# Altium project LTE-GNSS Asset Tracker.PrjPcb (part 3 of 3)

## Sheet GPS.SchDoc
size A4
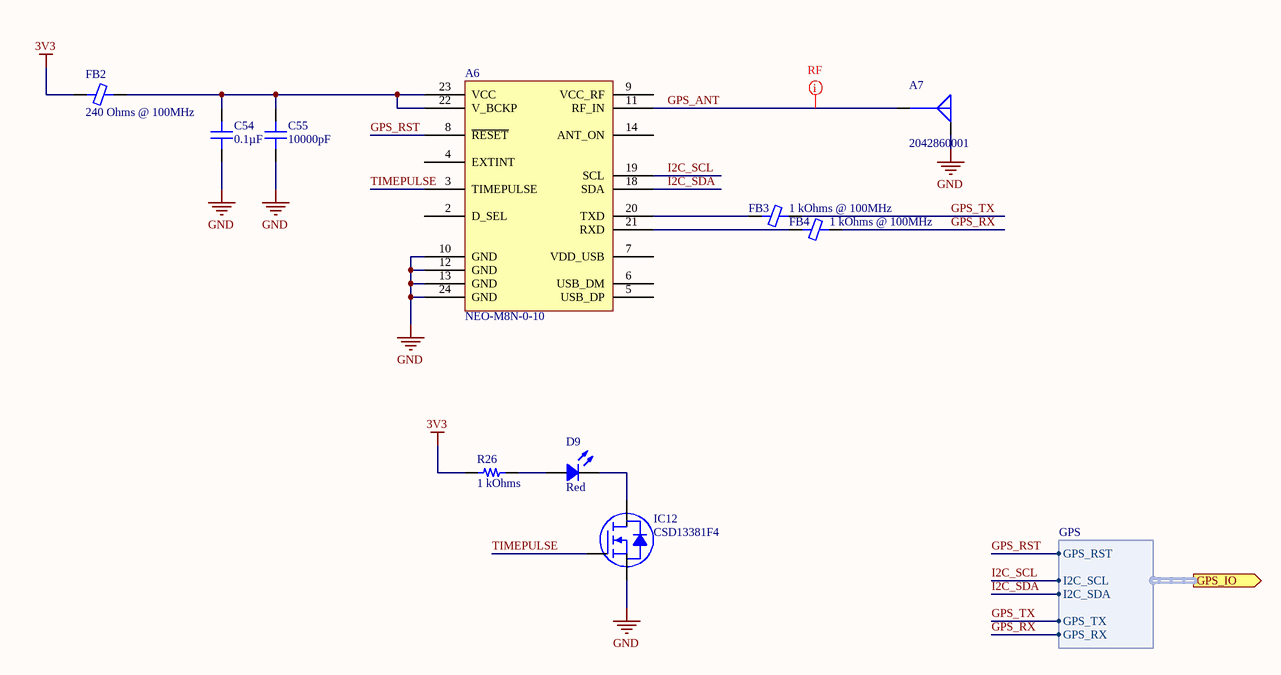
[diagram p6: GPS.SchDoc]

### Parts
A6  NEO-M8N-0-10  [U-BLOX NEO-M8N]
A7  2042860001  [MOLEX 2042860001]
C54  0.1µF  [CAP 0201_0603]
C55  10000pF  [CAP 0201_0603]
D9  Red  [LED 0402_1005 RED]
FB2  240 Ohms @ 100MHz  [FER 0201_0603]
FB3  1 kOhms @ 100MHz  [FER 0201_0603]
FB4  1 kOhms @ 100MHz  [FER 0201_0603]
IC12  CSD13381F4  [TI 3-XFDFN F4 YJC]
R26  1 kOhms  [RES 0201_0603]

### Ports
GPS_IO (out, harness GPS)

### Harnesses
GPS: I2C_SCL, I2C_SDA, GPS_TX, GPS_RX, GPS_RST

### Nets
3V3: FB2.1 R26.1
GND: A6.10(GND) A6.12(GND) A6.13(GND) A6.24(GND) A7.G C54.1 C55.1 IC12.S
GPS_ANT: A6.11(RF_IN) A7.S
GPS_RST: A6.8(~{RESET}) ; port GPS_IO.GPS_RST
GPS_RX: FB4.2 ; port GPS_IO.GPS_RX
GPS_TX: FB3.2 ; port GPS_IO.GPS_TX
I2C_SCL: A6.19(SCL) ; port GPS_IO.I2C_SCL
I2C_SDA: A6.18(SDA) ; port GPS_IO.I2C_SDA
TIMEPULSE: A6.3(TIMEPULSE) IC12.G
NetA6_20: A6.20(TXD) FB3.1
NetA6_21: A6.21(RXD) FB4.1
NetA6_22: A6.22(V_BCKP) A6.23(VCC) C54.2 C55.2 FB2.2
NetD9_1: D9.1 R26.2
NetD9_2: D9.2 IC12.D

Not connected (* = marked no-connect by the designer): A6 2(D_SEL) 4(EXTINT) 5(USB_DP) 6(USB_DM) 7(VDD_USB) 9(VCC_RF) 14(ANT_ON)

### Layout directives
net class RF: GPS_ANT

### Notes on the sheet
- Title
- Size:
- Date:
- A4
- Number:
- Time:
- Revision:
- Sheet
- of
- File:

### Library data of the parts
A6 = NEO-M8N-0-10: RF RCVR GNSS/GPS 1.575GHZ 24LCC; Manufacturer: U-Blox America Inc.; Current - Receiving: 21mA; Data Interface: I2C, SPI, UART, USB; Modulation or Protocol: BeiDou, Galileo, GLONASS, GNSS, GPS; Sensitivity: -167dBm; Voltage - Supply: 1.65V ~ 3.6V; Part Number: NEO-M8N-0-10; Applications: General Purpose; ComponentLink1Description: Datasheet; ComponentLink1URL: https://www.u-blox.com/sites/default/files/NEO-M8-FW3_DataSheet_%28UBX-15031086%29.pdf; ComponentLink2Description: DigiKey Link; ComponentLink2URL: http://digikey.com/product-detail/en/u-blox-america-inc/NEO-M8N-0-10/672-NEO-M8N-0-10CT-ND/6150671; Device Package: 24-SMD Module; Frequency: 1.575GHz; LastUpdated: 04/01/2020 00:19:34; Lifecycle Status: Active; Minimum Order: 1; Operating Temperature: -40°C ~ 85°C; Package / Case: 24-SMD Module; Packaging: ReReel; PartId: 3; Part Status: Active; Price: 0.00; Series: NEO-M8; Supplier 1: DigiKey; Supplier Part Number 1: 672-NEO-M8N-0-10CT-ND
A7 = 2042860001: RF ANT CER PATCH SOLDER SMD; Manufacturer: Molex; Antenna Type: Ceramic Patch; Frequency Group: UHF (1GHz ~ 2GHz); Gain: 5.5dBi; Number of Bands: 1; Return Loss: -10dB; RF Family/Standard: Navigation; Part Number: 2042860001; Applications: Beidou, GLONASS, GPS; ComponentLink1Description: Datasheet; ComponentLink1URL: http://www.literature.molex.com/SQLImages/kelmscott/Molex/PDF_Images/987651-5071.pdf; ComponentLink2Description: DigiKey Link; ComponentLink2URL: http://digikey.com/product-detail/en/molex/2042860001/WM16802-ND/7566910; Height (Max): 0.157" (4.00mm); LastUpdated: 12/12/2019 06:31:41; Lifecycle Status: 0; Minimum Order: 1; Mounting Type: Through Hole; Packaging: Tray; Part Status: Active; Price: 2.23; Series: *; Supplier 1: DigiKey; Supplier Part Number 1: WM16802-ND; Termination: Solder
C54 = GRM033R61C104ME84D: CAP CER 0.1UF 16V X5R 0201; Manufacturer: Murata Electronics; Tolerance: ±20%; Part Number: GRM033R61C104ME84D; Value: 0.1µF; Applications: General Purpose; Capacitance: 0.1µF; ComponentLink1Description: Datasheet; ComponentLink1URL: https://search.murata.co.jp/Ceramy/image/img/A01X/G101/ENG/GRM033R61C104ME84-01.pdf; ComponentLink2Description: DigiKey Link; ComponentLink2URL: http://digikey.com/product-detail/en/murata-electronics/GRM033R61C104ME84D/490-9986-1-ND/5026291; Device Package: 0201 (0603 Metric); LastUpdated: 21/01/2020 00:00:12; Lifecycle Status: Active; Minimum Order: 1; Mounting Type: Surface Mount, MLCC; Operating Temperature: -55°C ~ 85°C; Package / Case: 0201 (0603 Metric); Packaging: TapeAndReel; PartId: 1522; Part Status: Active; Price: 0.01; Series: GRM; Size / Dimension: 0.024" L x 0.012" W (0.60mm x 0.30mm); Supplier 1: DigiKey; Supplier Part Number 1: 490-9986-1-ND; Temperature Coefficient: X5R; Thickness (Max): 0.013" (0.33mm); Voltage - Rated: 16V
C55 = CGA1A2X7R0J103M030BA: CAP CER 10000PF 6.3V X7R 0201; Manufacturer: TDK Corporation; Tolerance: ±20%; Part Number: CGA1A2X7R0J103M030BA; Value: 10000pF; Applications: Automotive; Capacitance: 10000pF; ComponentLink1Description: Datasheet; ComponentLink1URL: https://product.tdk.com/info/en/catalog/datasheets/mlcc_automotive_general_en.pdf?ref_disty=digikey; ComponentLink2Description: DigiKey Link; ComponentLink2URL: http://digikey.com/product-detail/en/tdk-corporation/CGA1A2X7R0J103M030BA/445-12116-1-ND/3953782; Device Package: 0201 (0603 Metric); LastUpdated: 21/01/2020 00:00:11; Lifecycle Status: Active; Minimum Order: 1; Mounting Type: Surface Mount, MLCC; Operating Temperature: -55°C ~ 125°C; Package / Case: 0201 (0603 Metric); Packaging: TapeAndReel; PartId: 1683; Part Status: Active; Price: 0.01; Ratings: AEC-Q200; Series: CGA; Size / Dimension: 0.024" L x 0.012" W (0.60mm x 0.30mm); Supplier 1: DigiKey; Supplier Part Number 1: 445-12116-1-ND; Temperature Coefficient: X7R; Thickness (Max): 0.013" (0.33mm); Voltage - Rated: 6.3V
D9 = IN-S42ATR: LED RED CLEAR 0402 SMD; Manufacturer: Inolux; Configuration: Standard; Current - Test: 20mA; Lens Size: 0.60mm x 0.45mm; Lens Style: Rectangle with Flat Top; Millicandela Rating: 90mcd; Viewing Angle: 130°; Voltage - Forward (Vf) (Typ): 2.1V; Wavelength - Dominant: 631nm; Wavelength - Peak: 645nm; Part Number: IN-S42ATR; Color: Red; ComponentLink1Description: Datasheet; ComponentLink1URL: http://www.inolux-corp.com/datasheet/SMDLED/Mono%20Color%20Top%20View/IN-S42AT%20Series_V1.1.pdf; ComponentLink2Description: DigiKey Link; ComponentLink2URL: http://digikey.com/product-detail/en/inolux/IN-S42ATR/1830-1057-1-ND/7604692; Device Package: 0402 (1005 Metric); Height (Max): 0.55mm; LastUpdated: 21/01/2020 03:12:45; Lens Color: Clear; Lens Transparency: Clear; Lifecycle Status: Active; Minimum Order: 1; Mounting Type: Surface Mount; Package / Case: 0402 (1005 Metric); Packaging: TapeAndReel; PartId: 504; Part Status: Active; Price: 0.06; Series: IN-S42AT; Size / Dimension: 1.00mm L x 0.50mm W; Supplier 1: DigiKey; Supplier Part Number 1: 1830-1057-1-ND; Supplier Device Package: 0402; Value: Red
FB2 = BK0603TS241-T: FERRITE BEAD 240 OHM 0201 1LN; Manufacturer: Taiyo Yuden; Current Rating (Max): 400mA; DC Resistance (DCR) (Max): 320mOhm; Number of Lines: 1; Part Number: BK0603TS241-T; ComponentLink1Description: Datasheet; ComponentLink1URL: https://ds.yuden.co.jp/TYCOMPAS/ut/detail?pn=BK0603TS241-T  &u=M; ComponentLink2Description: DigiKey Link; ComponentLink2URL: http://digikey.com/product-detail/en/taiyo-yuden/BK0603TS241-T/587-3276-1-ND/4157923; Device Package: 0201 (0603 Metric); Height (Max): 0.013" (0.33mm); Impedance @ Frequency: 240 Ohms @ 100MHz; LastUpdated: 21/01/2020 02:24:59; Lifecycle Status: Active; Minimum Order: 1; Mounting Type: Surface Mount; Operating Temperature: -55°C ~ 125°C; Package / Case: 0201 (0603 Metric); Packaging: TapeAndReel; PartId: 40; Part Status: Active; Price: 0.03; Series: BK; Size / Dimension: 0.024" L x 0.012" W (0.60mm x 0.30mm); Supplier 1: DigiKey; Supplier Part Number 1: 587-3276-1-ND; Value: 240 Ohms @ 100MHz
FB3 FB4 = BK0603HR102-T: FERRITE BEAD 1 KOHM 0201 1LN; Manufacturer: Taiyo Yuden; Current Rating (Max): 220mA; DC Resistance (DCR) (Max): 1.15Ohm; Filter Type: Signal Line; Number of Lines: 1; Part Number: BK0603HR102-T; ComponentLink1Description: Datasheet; ComponentLink1URL: https://www.yuden.co.jp/productdata/catalog/mlci07_e.pdf; ComponentLink2Description: DigiKey Link; ComponentLink2URL: http://digikey.com/product-detail/en/taiyo-yuden/BK0603HR102-T/587-5408-1-ND/7067084; Device Package: 0201 (0603 Metric); Height (Max): 0.013" (0.33mm); Impedance @ Frequency: 1 kOhms @ 100MHz; LastUpdated: 21/01/2020 02:24:53; Lifecycle Status: Active; Minimum Order: 1; Mounting Type: Surface Mount; Operating Temperature: -55°C ~ 125°C; Package / Case: 0201 (0603 Metric); Packaging: CutTape; PartId: 137; Part Status: Active; Price: 0.10; Series: BK; Size / Dimension: 0.024" L x 0.012" W (0.60mm x 0.30mm); Supplier 1: DigiKey; Supplier Part Number 1: 587-5408-1-ND; Value: 1 kOhms @ 100MHz
IC12 = CSD13381F4: MOSFET N-CH 12V 2.1A 3PICOSTAR; Manufacturer: Texas Instruments; Current - Continuous Drain (Id) @ 25°C: 2.1A (Ta); Drive Voltage (Max Rds On,  Min Rds On): 1.8V, 4.5V; FET Type: N-Channel; Gate Charge (Qg) (Max) @ Vgs: 1.4nC @ 4.5V; Input Capacitance (Ciss) (Max) @ Vds: 200pF @ 6V; Power Dissipation (Max): 500mW (Ta); Rds On (Max) @ Id, Vgs: 180mOhm @ 500mA, 4.5V; Vgs (Max): 8V; Vgs(th) (Max) @ Id: 1.1V @ 250µA; Part Number: CSD13381F4; ComponentLink1Description: Datasheet; ComponentLink1URL: http://www.ti.com/general/docs/suppproductinfo.tsp?distId=10&gotoUrl=http%3A%2F%2Fwww.ti.com%2Flit%2Fgpn%2Fcsd13381f4; ComponentLink2Description: DigiKey Link; ComponentLink2URL: http://digikey.com/product-detail/en/texas-instruments/CSD13381F4/296-38912-1-ND/5143018; Device Package: 3-XFDFN; Drain to Source Voltage (Vdss): 12V; LastUpdated: 30/03/2020 15:00:54; Lifecycle Status: Active; Minimum Order: 1; Mounting Type: Surface Mount; Operating Temperature: -55°C ~ 150°C (TJ); Package / Case: 3-XFDFN; Packaging: TapeAndReel; Part Status: Active; Price: 0.07; Series: NexFET™; Supplier 1: DigiKey; Supplier Part Number 1: 296-38912-1-ND; Supplier Device Package: 3-PICOSTAR; Technology: MOSFET (Metal Oxide)
R26 = ERJ-1GNF1001C: RES SMD 1K OHM 1% 1/20W 0201; Manufacturer: Panasonic Electronic Components; Power (Watts): 0.05W, 1/20W; Temperature Coefficient: ±200ppm/°C; Part Number: ERJ-1GNF1001C; Value: 1 kOhms; ComponentLink1Description: Datasheet; ComponentLink1URL: https://industrial.panasonic.com/cdbs/www-data/pdf/RDA0000/AOA0000C304.pdf; ComponentLink2Description: DigiKey Link; ComponentLink2URL: http://digikey.com/product-detail/en/panasonic-electronic-components/ERJ-1GNF1001C/P122413CT-ND/7389439; Composition: Thick Film; Device Package: 0201 (0603 Metric); Features: Automotive AEC-Q200; Height - Seated (Max): 0.010" (0.26mm); LastUpdated: 21/01/2020 00:04:13; Lifecycle Status: Active; Minimum Order: 1; Number of Terminations: 2; Operating Temperature: -55°C ~ 125°C; Package / Case: 0201 (0603 Metric); Packaging: TapeAndReel; PartId: 2298; Part Status: Active; Price: 0.01; Ratings: AEC-Q200; Resistance: 1 kOhms; Series: ERJ; Size / Dimension: 0.024" L x 0.012" W (0.60mm x 0.30mm); Supplier 1: DigiKey; Supplier Part Number 1: P122413CT-ND; Supplier Device Package: 0201; Tolerance: ±1%

## Sheet Accelerometer.SchDoc
size A4
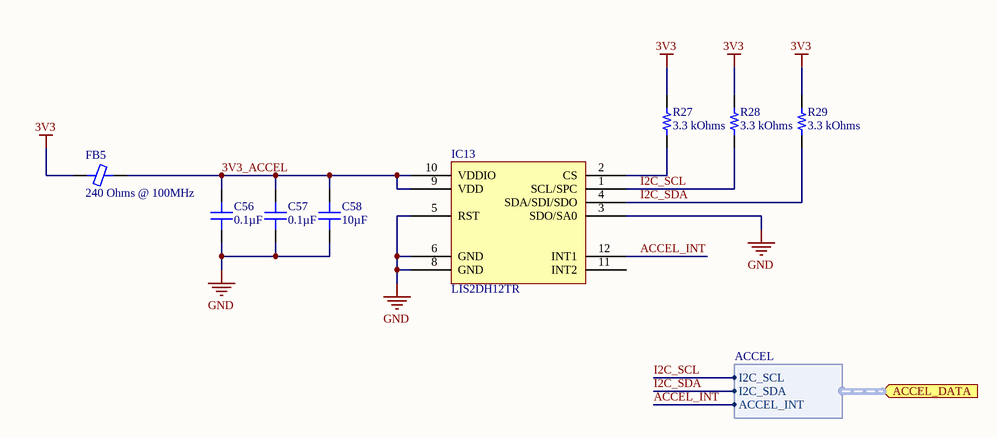
[diagram p7: Accelerometer.SchDoc]

### Parts
C56  0.1µF  [CAP 0201_0603]
C57  0.1µF  [CAP 0201_0603]
C58  10µF  [CAP 0603_1608]
FB5  240 Ohms @ 100MHz  [FER 0201_0603]
IC13  LIS2DH12TR  [ST LGA-12 2x2MM]
R27  3.3 kOhms  [RES 0201_0603]
R28  3.3 kOhms  [RES 0201_0603]
R29  3.3 kOhms  [RES 0201_0603]

### Ports
ACCEL_DATA (in, harness ACCEL)

### Harnesses
ACCEL: I2C_SCL, I2C_SDA, ACCEL_INT

### Nets
3V3: FB5.1 R27.2 R28.2 R29.2
GND: C56.1 C57.1 C58.1 IC13.3(SDO/SA0) IC13.5(RST) IC13.6(GND) IC13.8(GND)
3V3_ACCEL: C56.2 C57.2 C58.2 FB5.2 IC13.9(VDD) IC13.10(VDDIO)
ACCEL_INT: IC13.12(INT1) ; port ACCEL_DATA.ACCEL_INT
I2C_SCL: IC13.1(SCL/SPC) R28.1 ; port ACCEL_DATA.I2C_SCL
I2C_SDA: IC13.4(SDA/SDI/SDO) R29.1 ; port ACCEL_DATA.I2C_SDA
NetIC13_2: IC13.2(CS) R27.1

Not connected (* = marked no-connect by the designer): IC13 11(INT2)

### Notes on the sheet
- Title
- Size:
- Date:
- A4
- Number:
- Time:
- Revision:
- Sheet
- of
- File:

### Library data of the parts
C56 C57 = GRM033R61C104ME84D: as C54 on sheet GPS; Part Number: GRM033R61C104ME84D; Value: 0.1µF; Applications: General Purpose; Capacitance: 0.1µF; ComponentLink1Description: Datasheet; ComponentLink1URL: https://search.murata.co.jp/Ceramy/image/img/A01X/G101/ENG/GRM033R61C104ME84-01.pdf; ComponentLink2Description: DigiKey Link; ComponentLink2URL: http://digikey.com/product-detail/en/murata-electronics/GRM033R61C104ME84D/490-9986-1-ND/5026291; Device Package: 0201 (0603 Metric); LastUpdated: 21/01/2020 00:00:12; Lifecycle Status: Active; Minimum Order: 1; Mounting Type: Surface Mount, MLCC; Operating Temperature: -55°C ~ 85°C; Package / Case: 0201 (0603 Metric); Packaging: TapeAndReel; PartId: 1522; Part Status: Active; Price: 0.01; Series: GRM; Size / Dimension: 0.024" L x 0.012" W (0.60mm x 0.30mm); Supplier 1: DigiKey; Supplier Part Number 1: 490-9986-1-ND; Temperature Coefficient: X5R; Thickness (Max): 0.013" (0.33mm); Voltage - Rated: 16V
C58 = LMK107BBJ106KALT: CAP CER 10UF 10V X5R 0603; Manufacturer: Taiyo Yuden; Tolerance: ±10%; Part Number: LMK107BBJ106KALT; Value: 10µF; Applications: SMPS Filtering; Capacitance: 10µF; ComponentLink1Description: Datasheet; ComponentLink1URL: https://ds.yuden.co.jp/TYCOMPAS/ut/detail?pn=LMK107BBJ106KALT &u=M; ComponentLink2Description: DigiKey Link; ComponentLink2URL: http://digikey.com/product-detail/en/taiyo-yuden/LMK107BBJ106KALT/587-6017-1-ND/8040680; Device Package: 0603 (1608 Metric); LastUpdated: 21/01/2020 00:01:56; Lifecycle Status: Active; Minimum Order: 1; Mounting Type: Surface Mount, MLCC; Operating Temperature: -55°C ~ 85°C; Package / Case: 0603 (1608 Metric); Packaging: TapeAndReel; PartId: 10454; Part Status: Active; Price: 0.03; Series: M; Size / Dimension: 0.063" L x 0.031" W (1.60mm x 0.80mm); Supplier 1: DigiKey; Supplier Part Number 1: 587-6017-1-ND; Temperature Coefficient: X5R; Thickness (Max): 0.039" (1.00mm); Voltage - Rated: 10V
FB5 = BK0603TS241-T: as FB2 on sheet GPS; Part Number: BK0603TS241-T; ComponentLink1Description: Datasheet; ComponentLink1URL: https://ds.yuden.co.jp/TYCOMPAS/ut/detail?pn=BK0603TS241-T  &u=M; ComponentLink2Description: DigiKey Link; ComponentLink2URL: http://digikey.com/product-detail/en/taiyo-yuden/BK0603TS241-T/587-3276-1-ND/4157923; Device Package: 0201 (0603 Metric); Height (Max): 0.013" (0.33mm); Impedance @ Frequency: 240 Ohms @ 100MHz; LastUpdated: 21/01/2020 02:24:59; Lifecycle Status: Active; Minimum Order: 1; Mounting Type: Surface Mount; Operating Temperature: -55°C ~ 125°C; Package / Case: 0201 (0603 Metric); Packaging: TapeAndReel; PartId: 40; Part Status: Active; Price: 0.03; Series: BK; Size / Dimension: 0.024" L x 0.012" W (0.60mm x 0.30mm); Supplier 1: DigiKey; Supplier Part Number 1: 587-3276-1-ND; Value: 240 Ohms @ 100MHz
IC13 = LIS2DH12TR: ACCEL 2-16G I2C/SPI 12LGA; Manufacturer: STMicroelectronics; Acceleration Range: ±2g, 4g, 8g, 16g; Axis: X, Y, Z; Bandwidth: 0.5Hz ~ 672Hz; Output Type: I²C, SPI; Sensitivity (LSB/g): 1000 (±2g) ~ 83 (±16g); Voltage - Supply: 1.71V ~ 3.6V; Part Number: LIS2DH12TR; ComponentLink1Description: Datasheet; ComponentLink1URL: http://www.st.com/content/ccc/resource/technical/document/datasheet/12/c0/5c/36/b9/58/46/f2/DM00091513.pdf/files/DM00091513.pdf/jcr:content/translations/en.DM00091513.pdf; ComponentLink2Description: DigiKey Link; ComponentLink2URL: http://digikey.com/product-detail/en/stmicroelectronics/LIS2DH12TR/497-14851-1-ND/4899838; Device Package: 12-VFLGA; Features: Adjustable Bandwidth, Selectable Scale, Sleep Mode, Temperature Sensor; LastUpdated: 30/03/2020 15:41:11; Lifecycle Status: Active; Minimum Order: 1; Mounting Type: Surface Mount; Operating Temperature: -40°C ~ 85°C (TA); Package / Case: 12-VFLGA; Packaging: TapeAndReel; Part Status: Active; Price: 0.60; Series: -; Supplier 1: DigiKey; Supplier Part Number 1: 497-14851-1-ND; Supplier Device Package: 12-LGA (2x2); Type: Digital
R27-R29 = ERJ-1GNF3301C: RES SMD 3.3K OHM 1% 1/20W 0201; Manufacturer: Panasonic Electronic Components; Power (Watts): 0.05W, 1/20W; Temperature Coefficient: ±200ppm/°C; Part Number: ERJ-1GNF3301C; Value: 3.3 kOhms; ComponentLink1Description: Datasheet; ComponentLink1URL: https://industrial.panasonic.com/cdbs/www-data/pdf/RDA0000/AOA0000C304.pdf; ComponentLink2Description: DigiKey Link; ComponentLink2URL: http://digikey.com/product-detail/en/panasonic-electronic-components/ERJ-1GNF3301C/P122937CT-ND/8342813; Composition: Thick Film; Device Package: 0201 (0603 Metric); Features: Automotive AEC-Q200; Height - Seated (Max): 0.010" (0.26mm); LastUpdated: 21/01/2020 00:04:10; Lifecycle Status: Active; Minimum Order: 1; Number of Terminations: 2; Operating Temperature: -55°C ~ 125°C; Package / Case: 0201 (0603 Metric); Packaging: TapeAndReel; PartId: 4142; Part Status: Active; Price: 0.01; Ratings: AEC-Q200; Resistance: 3.3 kOhms; Series: ERJ; Size / Dimension: 0.024" L x 0.012" W (0.60mm x 0.30mm); Supplier 1: DigiKey; Supplier Part Number 1: P122937CT-ND; Supplier Device Package: 0201; Tolerance: ±1%

## Sheet Battery Power.SchDoc
size A4
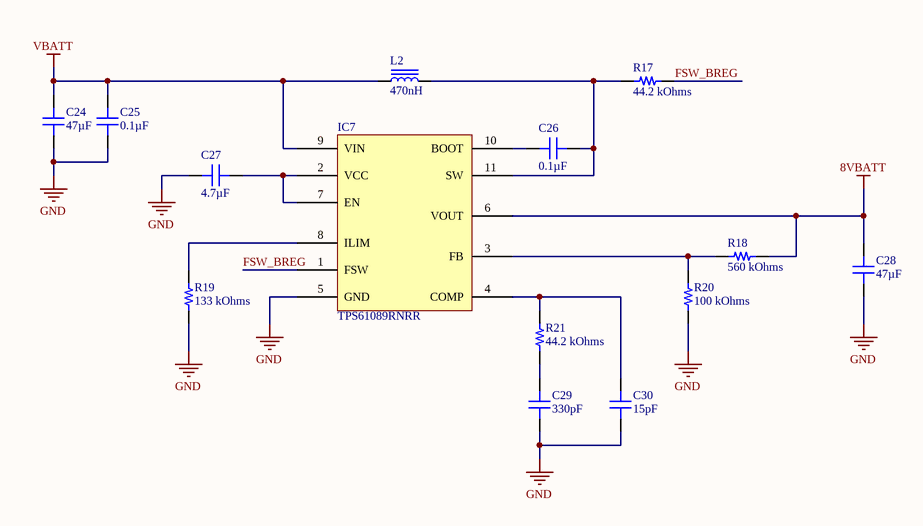
[diagram p8: Battery Power.SchDoc]

### Parts
C24  47µF  [CAP 1210_3225 - 2.8MM]
C25  0.1µF  [CAP 0201_0603]
C26  0.1µF  [CAP 0201_0603]
C27  4.7µF  [CAP 0402_1005]
C28  47µF  [CAP 1210_3225 - 2.8MM]
C29  330pF  [CAP 0201_0603]
C30  15pF  [CAP 0201_0603]
IC7  TPS61089RNRR  [TI VQFN-11 2.5x2.1 RNR]
L2  470nH  [BOURNS SRP5030T]
R17  44.2 kOhms  [RES 0201_0603]
R18  560 kOhms  [RES 0201_0603]
R19  133 kOhms  [RES 0201_0603]
R20  100 kOhms  [RES 0201_0603]
R21  44.2 kOhms  [RES 0201_0603]

### Nets
8VBATT: C28.2 IC7.6(VOUT) R18.1
GND: C24.1 C25.1 C27.1 C28.1 C29.1 C30.1 IC7.5(GND) R19.1 R20.1
VBATT: C24.2 C25.2 IC7.9(VIN) L2.1
FSW_BREG: IC7.1(FSW) R17.2
NetC26_1: C26.1 IC7.11(SW) L2.2 R17.1
NetC26_2: C26.2 IC7.10(BOOT)
NetC27_2: C27.2 IC7.2(VCC) IC7.7(EN)
NetC29_2: C29.2 R21.1
NetC30_2: C30.2 IC7.4(COMP) R21.2
NetIC7_3: IC7.3(FB) R18.2 R20.2
NetIC7_8: IC7.8(ILIM) R19.2

### Notes on the sheet
- Title
- Size:
- Date:
- A4
- Number:
- Time:
- Revision:
- Sheet
- of
- File:

### Library data of the parts
C24 = LMK325B7476MM-PR: CAP CER 47UF 10V X7R 1210; Manufacturer: Taiyo Yuden; Tolerance: ±20%; Part Number: LMK325B7476MM-PR; Value: 47µF; Applications: General Purpose; Capacitance: 47µF; ComponentLink1Description: Datasheet; ComponentLink1URL: https://www.yuden.co.jp/productdata/catalog/mlcc01_e.pdf; ComponentLink2Description: DigiKey Link; ComponentLink2URL: http://digikey.com/product-detail/en/taiyo-yuden/LMK325B7476MM-PR/587-5922-1-ND/7675042; Device Package: 1210 (3225 Metric); LastUpdated: 21/01/2020 00:30:21; Lifecycle Status: Active; Minimum Order: 1; Mounting Type: Surface Mount, MLCC; Operating Temperature: -55°C ~ 125°C; Package / Case: 1210 (3225 Metric); Packaging: TapeAndReel; PartId: 24091; Part Status: Active; Price: 0.28; Series: M; Size / Dimension: 0.126" L x 0.098" W (3.20mm x 2.50mm); Supplier 1: DigiKey; Supplier Part Number 1: 587-5922-1-ND; Temperature Coefficient: X7R; Thickness (Max): 0.106" (2.70mm); Voltage - Rated: 10V
C25 C26 = GRM033R61C104ME84D: as C54 on sheet GPS; Part Number: GRM033R61C104ME84D; Value: 0.1µF; Applications: General Purpose; Capacitance: 0.1µF; ComponentLink1Description: Datasheet; ComponentLink1URL: https://search.murata.co.jp/Ceramy/image/img/A01X/G101/ENG/GRM033R61C104ME84-01.pdf; ComponentLink2Description: DigiKey Link; ComponentLink2URL: http://digikey.com/product-detail/en/murata-electronics/GRM033R61C104ME84D/490-9986-1-ND/5026291; Device Package: 0201 (0603 Metric); LastUpdated: 21/01/2020 00:00:12; Lifecycle Status: Active; Minimum Order: 1; Mounting Type: Surface Mount, MLCC; Operating Temperature: -55°C ~ 85°C; Package / Case: 0201 (0603 Metric); Packaging: TapeAndReel; PartId: 1522; Part Status: Active; Price: 0.01; Series: GRM; Size / Dimension: 0.024" L x 0.012" W (0.60mm x 0.30mm); Supplier 1: DigiKey; Supplier Part Number 1: 490-9986-1-ND; Temperature Coefficient: X5R; Thickness (Max): 0.013" (0.33mm); Voltage - Rated: 16V
C27 = CL05A475KP5NRNC: CAP CER 4.7UF 10V X5R 0402; Manufacturer: Samsung Electro-Mechanics; Tolerance: ±10%; Part Number: CL05A475KP5NRNC; Value: 4.7µF; Applications: General Purpose; Capacitance: 4.7µF; ComponentLink1Description: Datasheet; ComponentLink1URL: http://www.samsungsem.com/kr/support/product-search/mlcc/CL05A475KP5NRNC.jsp; ComponentLink2Description: DigiKey Link; ComponentLink2URL: http://digikey.com/product-detail/en/samsung-electro-mechanics/CL05A475KP5NRNC/1276-1480-1-ND/3889566; Device Package: 0402 (1005 Metric); LastUpdated: 01/04/2020 23:57:03; Lifecycle Status: Active; Minimum Order: 1; Mounting Type: Surface Mount, MLCC; Operating Temperature: -55°C ~ 85°C; Package / Case: 0402 (1005 Metric); Packaging: TapeAndReel; PartId: 2191; Part Status: Active; Price: 0.08; Series: CL; Size / Dimension: 0.039" L x 0.020" W (1.00mm x 0.50mm); Supplier 1: DigiKey; Supplier Part Number 1: 1276-1480-1-ND; Temperature Coefficient: X5R; Thickness (Max): 0.022" (0.55mm); Voltage - Rated: 10V
C28 = C1210C476M4PACTU: CAP CER 47UF 16V X5R 1210; Manufacturer: KEMET; Tolerance: ±20%; Part Number: C1210C476M4PACTU; Value: 47µF; Applications: General Purpose; Capacitance: 47µF; ComponentLink1Description: Datasheet; ComponentLink1URL: https://api.kemet.com/component-edge/download/datasheet/C1210C476M4PACTU.pdf; ComponentLink2Description: DigiKey Link; ComponentLink2URL: http://digikey.com/product-detail/en/kemet/C1210C476M4PACTU/399-5514-1-ND/1950692; Device Package: 1210 (3225 Metric); LastUpdated: 21/01/2020 00:30:39; Lifecycle Status: Active; Minimum Order: 1; Mounting Type: Surface Mount, MLCC; Operating Temperature: -55°C ~ 85°C; Package / Case: 1210 (3225 Metric); Packaging: TapeAndReel; PartId: 23816; Part Status: Active; Price: 0.38; Series: SMD Comm X5R; Size / Dimension: 0.126" L x 0.098" W (3.20mm x 2.50mm); Supplier 1: DigiKey; Supplier Part Number 1: 399-5514-1-ND; Temperature Coefficient: X5R; Thickness (Max): 0.110" (2.80mm); Voltage - Rated: 16V
C29 = CL03B331KA3NNNC: CAP CER 330PF 25V X7R 0201; Manufacturer: Samsung Electro-Mechanics; Tolerance: ±10%; Part Number: CL03B331KA3NNNC; Value: 330pF; Applications: General Purpose; Capacitance: 330pF; ComponentLink1Description: Datasheet; ComponentLink1URL: http://www.samsungsem.com/kr/support/product-search/mlcc/CL03B331KA3NNNC.jsp; ComponentLink2Description: DigiKey Link; ComponentLink2URL: http://digikey.com/product-detail/en/samsung-electro-mechanics/CL03B331KA3NNNC/1276-1351-1-ND/3889437; Device Package: 0201 (0603 Metric); LastUpdated: 21/01/2020 00:00:16; Lifecycle Status: Active; Minimum Order: 1; Mounting Type: Surface Mount, MLCC; Operating Temperature: -55°C ~ 125°C; Package / Case: 0201 (0603 Metric); Packaging: TapeAndReel; PartId: 781; Part Status: Active; Price: 0.01; Series: CL; Size / Dimension: 0.024" L x 0.012" W (0.60mm x 0.30mm); Supplier 1: DigiKey; Supplier Part Number 1: 1276-1351-1-ND; Temperature Coefficient: X7R; Thickness (Max): 0.013" (0.33mm); Voltage - Rated: 25V
C30 = CGA1A2C0G1E150J030BA: CAP CER 15PF 25V C0G 0201; Manufacturer: TDK Corporation; Temperature Coefficient: C0G, NP0; Tolerance: ±5%; Part Number: CGA1A2C0G1E150J030BA; Value: 15pF; Applications: Automotive; Capacitance: 15pF; ComponentLink1Description: Datasheet; ComponentLink1URL: https://product.tdk.com/info/en/catalog/datasheets/mlcc_automotive_general_en.pdf?ref_disty=digikey; ComponentLink2Description: DigiKey Link; ComponentLink2URL: http://digikey.com/product-detail/en/tdk-corporation/CGA1A2C0G1E150J030BA/445-9034-1-ND/3648614; Device Package: 0201 (0603 Metric); LastUpdated: 21/01/2020 00:00:11; Lifecycle Status: Active; Minimum Order: 1; Mounting Type: Surface Mount, MLCC; Operating Temperature: -55°C ~ 125°C; Package / Case: 0201 (0603 Metric); Packaging: TapeAndReel; PartId: 1675; Part Status: Active; Price: 0.01; Ratings: AEC-Q200; Series: CGA; Size / Dimension: 0.024" L x 0.012" W (0.60mm x 0.30mm); Supplier 1: DigiKey; Supplier Part Number 1: 445-9034-1-ND; Thickness (Max): 0.013" (0.33mm); Voltage - Rated: 25V
IC7 = TPS61089RNRR: IC REG BOOST ADJ 7A 11VQFN; Manufacturer: Texas Instruments; Frequency - Switching: 200kHz ~ 2.2MHz; Function: Step-Up; Number of Outputs: 1; Output Configuration: Positive; Output Type: Adjustable; Synchronous Rectifier: Yes; Voltage - Input (Max): 12V; Voltage - Input (Min): 2.7V; Voltage - Output (Max): 12.6V; Voltage - Output (Min/Fixed): 4.5V; Part Number: TPS61089RNRR; ComponentLink1Description: Datasheet; ComponentLink1URL: http://www.ti.com/general/docs/suppproductinfo.tsp?distId=10&gotoUrl=http%3A%2F%2Fwww.ti.com%2Flit%2Fgpn%2Ftps61089; ComponentLink2Description: DigiKey Link; ComponentLink2URL: http://digikey.com/product-detail/en/texas-instruments/TPS61089RNRR/296-47295-1-ND/7688305; Current - Output: 7A; Device Package: 11-VFQFN; LastUpdated: 05/04/2020 02:30:28; Lifecycle Status: Active; Minimum Order: 1; Mounting Type: Surface Mount; Operating Temperature: -40°C ~ 125°C (TJ); Package / Case: 11-VFQFN; Packaging: TapeAndReel; Part Status: Active; Price: 1.26; Series: -; Supplier 1: DigiKey; Supplier Part Number 1: 296-47295-1-ND; Supplier Device Package: 11-VQFN-HR (2.5x2); Topology: Boost
L2 = SRP5030T-R47M: FIXED IND 470NH 12A 7.4 MOHM SMD; Manufacturer: Bourns Inc.; Current - Saturation: 16A; DC Resistance (DCR): 7.4mOhm Max; Inductance Frequency - Test: 100kHz; Material - Core: Iron Powder; Shielding: Shielded; Tolerance: ±20%; Type: Wirewound; Part Number: SRP5030T-R47M; ComponentLink1Description: Datasheet; ComponentLink1URL: https://www.bourns.com/docs/Product-Datasheets/SRP5030T.pdf; ComponentLink2Description: DigiKey Link; ComponentLink2URL: http://digikey.com/product-detail/en/bourns-inc/SRP5030T-R47M/SRP5030T-R47MCT-ND/3986019; Current Rating (Amps): 12A; Device Package: Nonstandard; Height - Seated (Max): 0.118" (3.00mm); Inductance: 470nH; LastUpdated: 21/01/2020 03:25:23; Lifecycle Status: Active; Minimum Order: 1; Mounting Type: Surface Mount; Operating Temperature: -40°C ~ 125°C; Package / Case: Nonstandard; Packaging: TapeAndReel; PartId: 5; Part Status: Active; Price: 0.66; Series: SRP5030T; Size / Dimension: 0.224" L x 0.205" W (5.70mm x 5.20mm); Supplier 1: DigiKey; Supplier Part Number 1: SRP5030T-R47MCT-ND; Value: 470nH
R17 R21 = ERJ-1GNF4422C: RES SMD 44.2K OHM 1% 1/20W 0201; Manufacturer: Panasonic Electronic Components; Power (Watts): 0.05W, 1/20W; Temperature Coefficient: ±200ppm/°C; Part Number: ERJ-1GNF4422C; Value: 44.2 kOhms; ComponentLink1Description: Datasheet; ComponentLink1URL: https://industrial.panasonic.com/cdbs/www-data/pdf/RDA0000/AOA0000C304.pdf; ComponentLink2Description: DigiKey Link; ComponentLink2URL: http://digikey.com/product-detail/en/panasonic-electronic-components/ERJ-1GNF4422C/P123017CT-ND/8342973; Composition: Thick Film; Device Package: 0201 (0603 Metric); Features: Automotive AEC-Q200; Height - Seated (Max): 0.010" (0.26mm); LastUpdated: 21/01/2020 00:04:13; Lifecycle Status: Active; Minimum Order: 1; Number of Terminations: 2; Operating Temperature: -55°C ~ 125°C; Package / Case: 0201 (0603 Metric); Packaging: TapeAndReel; PartId: 2403; Part Status: Active; Price: 0.01; Ratings: AEC-Q200; Resistance: 44.2 kOhms; Series: ERJ; Size / Dimension: 0.024" L x 0.012" W (0.60mm x 0.30mm); Supplier 1: DigiKey; Supplier Part Number 1: P123017CT-ND; Supplier Device Package: 0201; Tolerance: ±1%
R18 = ERJ-1GNF5603C: RES SMD 560K OHM 1% 1/20W 0201; Manufacturer: Panasonic Electronic Components; Power (Watts): 0.05W, 1/20W; Temperature Coefficient: ±200ppm/°C; Part Number: ERJ-1GNF5603C; Value: 560 kOhms; ComponentLink1Description: Datasheet; ComponentLink1URL: https://industrial.panasonic.com/cdbs/www-data/pdf/RDA0000/AOA0000C304.pdf; ComponentLink2Description: DigiKey Link; ComponentLink2URL: http://digikey.com/product-detail/en/panasonic-electronic-components/ERJ-1GNF5603C/P123077CT-ND/8343093; Composition: Thick Film; Device Package: 0201 (0603 Metric); Features: Automotive AEC-Q200; Height - Seated (Max): 0.010" (0.26mm); LastUpdated: 21/01/2020 00:04:10; Lifecycle Status: Active; Minimum Order: 1; Number of Terminations: 2; Operating Temperature: -55°C ~ 125°C; Package / Case: 0201 (0603 Metric); Packaging: TapeAndReel; PartId: 4184; Part Status: Active; Price: 0.01; Ratings: AEC-Q200; Resistance: 560 kOhms; Series: ERJ; Size / Dimension: 0.024" L x 0.012" W (0.60mm x 0.30mm); Supplier 1: DigiKey; Supplier Part Number 1: P123077CT-ND; Supplier Device Package: 0201; Tolerance: ±1%
R19 = ERJ-1GNF1333C: RES SMD 133K OHM 1% 1/20W 0201; Manufacturer: Panasonic Electronic Components; Power (Watts): 0.05W, 1/20W; Temperature Coefficient: ±200ppm/°C; Part Number: ERJ-1GNF1333C; Value: 133 kOhms; ComponentLink1Description: Datasheet; ComponentLink1URL: https://industrial.panasonic.com/cdbs/www-data/pdf/RDA0000/AOA0000C304.pdf; ComponentLink2Description: DigiKey Link; ComponentLink2URL: http://digikey.com/product-detail/en/panasonic-electronic-components/ERJ-1GNF1333C/P122719CT-ND/8342377; Composition: Thick Film; Device Package: 0201 (0603 Metric); Features: Automotive AEC-Q200; Height - Seated (Max): 0.010" (0.26mm); LastUpdated: 21/01/2020 00:04:13; Lifecycle Status: Active; Minimum Order: 1; Number of Terminations: 2; Operating Temperature: -55°C ~ 125°C; Package / Case: 0201 (0603 Metric); Packaging: TapeAndReel; PartId: 2343; Part Status: Active; Price: 0.01; Ratings: AEC-Q200; Resistance: 133 kOhms; Series: ERJ; Size / Dimension: 0.024" L x 0.012" W (0.60mm x 0.30mm); Supplier 1: DigiKey; Supplier Part Number 1: P122719CT-ND; Supplier Device Package: 0201; Tolerance: ±1%
R20 = ERJ-1GNF1003C: RES SMD 100K OHM 1% 1/20W 0201; Manufacturer: Panasonic Electronic Components; Power (Watts): 0.05W, 1/20W; Temperature Coefficient: ±200ppm/°C; Part Number: ERJ-1GNF1003C; Value: 100 kOhms; ComponentLink1Description: Datasheet; ComponentLink1URL: https://industrial.panasonic.com/cdbs/www-data/pdf/RDA0000/AOA0000C304.pdf; ComponentLink2Description: DigiKey Link; ComponentLink2URL: http://digikey.com/product-detail/en/panasonic-electronic-components/ERJ-1GNF1003C/P122655CT-ND/8342249; Composition: Thick Film; Device Package: 0201 (0603 Metric); Features: Automotive AEC-Q200; Height - Seated (Max): 0.010" (0.26mm); LastUpdated: 21/01/2020 00:04:18; Lifecycle Status: Active; Minimum Order: 1; Number of Terminations: 2; Operating Temperature: -55°C ~ 125°C; Package / Case: 0201 (0603 Metric); Packaging: TapeAndReel; PartId: 819; Part Status: Active; Price: 0.01; Ratings: AEC-Q200; Resistance: 100 kOhms; Series: ERJ; Size / Dimension: 0.024" L x 0.012" W (0.60mm x 0.30mm); Supplier 1: DigiKey; Supplier Part Number 1: P122655CT-ND; Supplier Device Package: 0201; Tolerance: ±1%

## Sheet Microcontroller.SchDoc
size A4
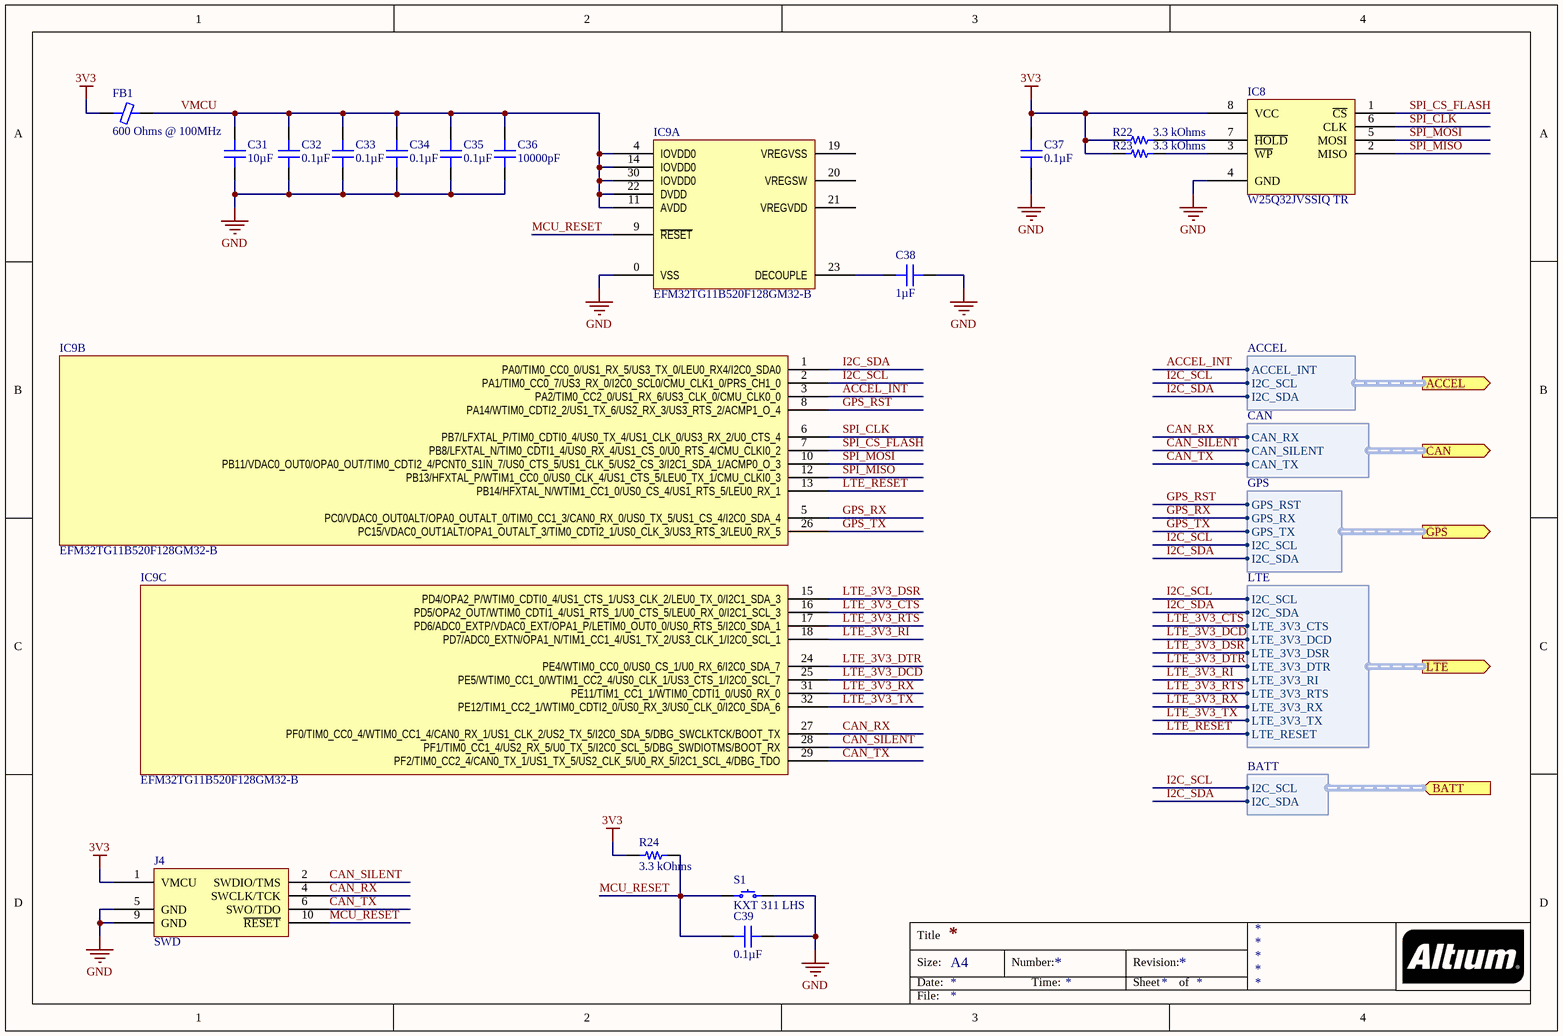
[diagram p9: Microcontroller.SchDoc]

### Parts
C31  10µF  [CAP 0402_1005]
C32  0.1µF  [CAP 0201_0603]
C33  0.1µF  [CAP 0201_0603]
C34  0.1µF  [CAP 0201_0603]
C35  0.1µF  [CAP 0201_0603]
C36  10000pF  [CAP 0201_0603]
C37  0.1µF  [CAP 0201_0603]
C38  1µF  [CAP 0402_1005]
C39  0.1µF  [CAP 0201_0603]
FB1  600 Ohms @ 100MHz  [FER 0402_1005]
IC8  W25Q32JVSSIQ TR  [WINBOND SOIC-8 208MIL WIDE]
IC9  EFM32TG11B520F128GM32-B  [SI LABS QFN-32(5x5)]  (parts A,B,C of 3)
J4  SWD  [10 Pin SWD]  (no BOM)
R22  3.3 kOhms  [RES 0201_0603]
R23  3.3 kOhms  [RES 0201_0603]
R24  3.3 kOhms  [RES 0201_0603]
S1  KXT 311 LHS  [C&K KXT3]

### Ports
ACCEL (out, harness ACCEL), BATT (in, harness BATT), CAN (out, harness CAN), GPS (out, harness GPS), LTE (out, harness LTE)

### Harnesses
ACCEL: ACCEL_INT, I2C_SCL, I2C_SDA
CAN: CAN_RX, CAN_SILENT, CAN_TX
GPS: GPS_RST, GPS_RX, GPS_TX, I2C_SCL, I2C_SDA
LTE: I2C_SCL, I2C_SDA, LTE_3V3_CTS, LTE_3V3_DCD, LTE_3V3_DSR, LTE_3V3_DTR, LTE_3V3_RI, LTE_3V3_RTS, LTE_3V3_RX, LTE_3V3_TX, LTE_RESET
BATT: I2C_SCL, I2C_SDA

### Nets
3V3: C37.2 FB1.1 IC8.8(VCC) J4.1(VMCU) R22.2 R23.2 R24.2
GND: C31.1 C32.1 C33.1 C34.1 C35.1 C36.1 C37.1 C38.2 C39.1 IC8.4(GND) IC9.0(VSS) J4.5(GND) J4.9(GND) S1.2
ACCEL_INT: IC9.3(PA2/TIM0_CC2_0/US1_RX_6/US3_CLK_0/CMU_CLK0_0) ; port ACCEL.ACCEL_INT
CAN_RX: IC9.27(PF0/TIM0_CC0_4/WTIM0_CC1_4/CAN0_RX_1/US1_CLK_2/US2_TX_5/I2C0_SDA_5/DBG_SWCLKTCK/BOOT_TX) J4.4(SWCLK/TCK) ; port CAN.CAN_RX
CAN_SILENT: IC9.28(PF1/TIM0_CC1_4/US2_RX_5/U0_TX_5/I2C0_SCL_5/DBG_SWDIOTMS/BOOT_RX) J4.2(SWDIO/TMS) ; port CAN.CAN_SILENT
CAN_TX: IC9.29(PF2/TIM0_CC2_4/CAN0_TX_1/US1_TX_5/US2_CLK_5/U0_RX_5/I2C1_SCL_4/DBG_TDO) J4.6(SWO/TDO) ; port CAN.CAN_TX
GPS_RST: IC9.8(PA14/WTIM0_CDTI2_2/US1_TX_6/US2_RX_3/US3_RTS_2/ACMP1_O_4) ; port GPS.GPS_RST
GPS_RX: IC9.5(PC0/VDAC0_OUT0ALT/OPA0_OUTALT_0/TIM0_CC1_3/CAN0_RX_0/US0_TX_5/US1_CS_4/I2C0_SDA_4) ; port GPS.GPS_RX
GPS_TX: IC9.26(PC15/VDAC0_OUT1ALT/OPA1_OUTALT_3/TIM0_CDTI2_1/US0_CLK_3/US3_RTS_3/LEU0_RX_5) ; port GPS.GPS_TX
I2C_SCL: IC9.2(PA1/TIM0_CC0_7/US3_RX_0/I2C0_SCL0/CMU_CLK1_0/PRS_CH1_0) ; port ACCEL.I2C_SCL, port GPS.I2C_SCL, port LTE.I2C_SCL, port BATT.I2C_SCL
I2C_SDA: IC9.1(PA0/TIM0_CC0_0/US1_RX_5/US3_TX_0/LEU0_RX4/I2C0_SDA0) ; port ACCEL.I2C_SDA, port GPS.I2C_SDA, port LTE.I2C_SDA, port BATT.I2C_SDA
LTE_3V3_CTS: IC9.16(PD5/OPA2_OUT/WTIM0_CDTI1_4/US1_RTS_1/U0_CTS_5/LEU0_RX_0/I2C1_SCL_3) ; port LTE.LTE_3V3_CTS
LTE_3V3_DCD: IC9.25(PE5/WTIM0_CC1_0/WTIM1_CC2_4/US0_CLK_1/US3_CTS_1/I2C0_SCL_7) ; port LTE.LTE_3V3_DCD
LTE_3V3_DSR: IC9.15(PD4/OPA2_P/WTIM0_CDTI0_4/US1_CTS_1/US3_CLK_2/LEU0_TX_0/I2C1_SDA_3) ; port LTE.LTE_3V3_DSR
LTE_3V3_DTR: IC9.24(PE4/WTIM0_CC0_0/US0_CS_1/U0_RX_6/I2C0_SDA_7) ; port LTE.LTE_3V3_DTR
LTE_3V3_RI: IC9.18(PD7/ADC0_EXTN/OPA1_N/TIM1_CC1_4/US1_TX_2/US3_CLK_1/I2C0_SCL_1) ; port LTE.LTE_3V3_RI
LTE_3V3_RTS: IC9.17(PD6/ADC0_EXTP/VDAC0_EXT/OPA1_P/LETIM0_OUT0_0/US0_RTS_5/I2C0_SDA_1) ; port LTE.LTE_3V3_RTS
LTE_3V3_RX: IC9.31(PE11/TIM1_CC1_1/WTIM0_CDTI1_0/US0_RX_0) ; port LTE.LTE_3V3_RX
LTE_3V3_TX: IC9.32(PE12/TIM1_CC2_1/WTIM0_CDTI2_0/US0_RX_3/US0_CLK_0/I2C0_SDA_6) ; port LTE.LTE_3V3_TX
LTE_RESET: IC9.13(PB14/HFXTAL_N/WTIM1_CC1_0/US0_CS_4/US1_RTS_5/LEU0_RX_1) ; port LTE.LTE_RESET
MCU_RESET: C39.2 IC9.9(~{RESET}) J4.10(~{RESET}) R24.1 S1.1
SPI_CLK: IC8.6(CLK) IC9.6(PB7/LFXTAL_P/TIM0_CDTI0_4/US0_TX_4/US1_CLK_0/US3_RX_2/U0_CTS_4)
SPI_CS_FLASH: IC8.1(~{CS}) IC9.7(PB8/LFXTAL_N/TIM0_CDTI1_4/US0_RX_4/US1_CS_0/U0_RTS_4/CMU_CLKI0_2)
SPI_MISO: IC8.2(MISO) IC9.12(PB13/HFXTAL_P/WTIM1_CC0_0/US0_CLK_4/US1_CTS_5/LEU0_TX_1/CMU_CLKI0_3)
SPI_MOSI: IC8.5(MOSI) IC9.10(PB11/VDAC0_OUT0/OPA0_OUT/TIM0_CDTI2_4/PCNT0_S1IN_7/US0_CTS_5/US1_CLK_5/US2_CS_3/I2C1_SDA_1/ACMP0_O_3)
VMCU: C31.2 C32.2 C33.2 C34.2 C35.2 C36.2 FB1.2 IC9.4(IOVDD0) IC9.11(AVDD) IC9.14(IOVDD0) IC9.22(DVDD) IC9.30(IOVDD0)
NetC38_1: C38.1 IC9.23(DECOUPLE)
NetIC8_3: IC8.3(~{WP}) R23.1
NetIC8_7: IC8.7(~{HOLD}) R22.1

Not connected (* = marked no-connect by the designer): IC9 19(VREGVSS) 20(VREGSW) 21(VREGVDD)

### Notes on the sheet
- Title
- Size:
- Date:
- A4
- Number:
- Time:
- Revision:
- Sheet
- of
- File:

### Library data of the parts
C31 = GRM155R60J106ME15D: CAP CER 10UF 6.3V X5R 0402; Manufacturer: Murata Electronics; Tolerance: ±20%; Part Number: GRM155R60J106ME15D; Value: 10µF; Applications: General Purpose; Capacitance: 10µF; ComponentLink1Description: Datasheet; ComponentLink1URL: https://www.murata.com/~/media/webrenewal/support/library/catalog/products/capacitor/mlcc/c02e.ashx?la=en-us; ComponentLink2Description: DigiKey Link; ComponentLink2URL: http://digikey.com/product-detail/en/murata-electronics/GRM155R60J106ME15D/490-13238-1-ND/5877446; Device Package: 0402 (1005 Metric); LastUpdated: 01/04/2020 23:56:51; Lifecycle Status: Active; Minimum Order: 1; Mounting Type: Surface Mount, MLCC; Operating Temperature: -55°C ~ 85°C; Package / Case: 0402 (1005 Metric); Packaging: TapeAndReel; PartId: 6754; Part Status: Active; Price: 0.03; Series: GRM; Size / Dimension: 0.039" L x 0.020" W (1.00mm x 0.50mm); Supplier 1: DigiKey; Supplier Part Number 1: 490-13238-1-ND; Temperature Coefficient: X5R; Thickness (Max): 0.026" (0.65mm); Voltage - Rated: 6.3V
C32-C35 C37 C39 = GRM033R61C104ME84D: as C54 on sheet GPS; Part Number: GRM033R61C104ME84D; Value: 0.1µF; Applications: General Purpose; Capacitance: 0.1µF; ComponentLink1Description: Datasheet; ComponentLink1URL: https://search.murata.co.jp/Ceramy/image/img/A01X/G101/ENG/GRM033R61C104ME84-01.pdf; ComponentLink2Description: DigiKey Link; ComponentLink2URL: http://digikey.com/product-detail/en/murata-electronics/GRM033R61C104ME84D/490-9986-1-ND/5026291; Device Package: 0201 (0603 Metric); LastUpdated: 21/01/2020 00:00:12; Lifecycle Status: Active; Minimum Order: 1; Mounting Type: Surface Mount, MLCC; Operating Temperature: -55°C ~ 85°C; Package / Case: 0201 (0603 Metric); Packaging: TapeAndReel; PartId: 1522; Part Status: Active; Price: 0.01; Series: GRM; Size / Dimension: 0.024" L x 0.012" W (0.60mm x 0.30mm); Supplier 1: DigiKey; Supplier Part Number 1: 490-9986-1-ND; Temperature Coefficient: X5R; Thickness (Max): 0.013" (0.33mm); Voltage - Rated: 16V
C36 = CGA1A2X7R0J103M030BA: as C55 on sheet GPS; Part Number: CGA1A2X7R0J103M030BA; Value: 10000pF; Applications: Automotive; Capacitance: 10000pF; ComponentLink1Description: Datasheet; ComponentLink1URL: https://product.tdk.com/info/en/catalog/datasheets/mlcc_automotive_general_en.pdf?ref_disty=digikey; ComponentLink2Description: DigiKey Link; ComponentLink2URL: http://digikey.com/product-detail/en/tdk-corporation/CGA1A2X7R0J103M030BA/445-12116-1-ND/3953782; Device Package: 0201 (0603 Metric); LastUpdated: 21/01/2020 00:00:11; Lifecycle Status: Active; Minimum Order: 1; Mounting Type: Surface Mount, MLCC; Operating Temperature: -55°C ~ 125°C; Package / Case: 0201 (0603 Metric); Packaging: TapeAndReel; PartId: 1683; Part Status: Active; Price: 0.01; Ratings: AEC-Q200; Series: CGA; Size / Dimension: 0.024" L x 0.012" W (0.60mm x 0.30mm); Supplier 1: DigiKey; Supplier Part Number 1: 445-12116-1-ND; Temperature Coefficient: X7R; Thickness (Max): 0.013" (0.33mm); Voltage - Rated: 6.3V
C38 = JMK105C6105KV-F: CAP CER 1UF 6.3V X6S 0402; Manufacturer: Taiyo Yuden; Tolerance: ±10%; Part Number: JMK105C6105KV-F; Value: 1µF; Applications: General Purpose; Capacitance: 1µF; ComponentLink1Description: Datasheet; ComponentLink1URL: https://www.yuden.co.jp/productdata/catalog/mlcc01_e.pdf; ComponentLink2Description: DigiKey Link; ComponentLink2URL: http://digikey.com/product-detail/en/taiyo-yuden/JMK105C6105KV-F/587-3381-1-ND/4157200; Device Package: 0402 (1005 Metric); LastUpdated: 01/04/2020 23:56:34; Lifecycle Status: Active; Minimum Order: 1; Mounting Type: Surface Mount, MLCC; Operating Temperature: -55°C ~ 105°C; Package / Case: 0402 (1005 Metric); Packaging: TapeAndReel; PartId: 12563; Part Status: Active; Price: 0.01; Series: M; Size / Dimension: 0.039" L x 0.020" W (1.00mm x 0.50mm); Supplier 1: DigiKey; Supplier Part Number 1: 587-3381-1-ND; Temperature Coefficient: X6S; Thickness (Max): 0.022" (0.55mm); Voltage - Rated: 6.3V
FB1 = BLM15PX601SZ1D: FERRITE BEAD 600 OHM 0402 1LN; Manufacturer: Murata Electronics; Current Rating (Max): 900mA; DC Resistance (DCR) (Max): 230mOhm; Filter Type: Power Line; Number of Lines: 1; Part Number: BLM15PX601SZ1D; ComponentLink1Description: Datasheet; ComponentLink1URL: https://www.murata.com/en-us/products/productdata/8796748677150/QNFA9118.pdf; ComponentLink2Description: DigiKey Link; ComponentLink2URL: http://digikey.com/product-detail/en/murata-electronics/BLM15PX601SZ1D/490-16655-1-ND/7595577; Device Package: 0402 (1005 Metric); Height (Max): 0.022" (0.55mm); Impedance @ Frequency: 600 Ohms @ 100MHz; LastUpdated: 21/01/2020 02:26:14; Lifecycle Status: Active; Minimum Order: 1; Mounting Type: Surface Mount; Operating Temperature: -55°C ~ 125°C; Package / Case: 0402 (1005 Metric); Packaging: TapeAndReel; PartId: 191; Part Status: Active; Price: 0.03; Ratings: AEC-Q200; Series: BLM; Size / Dimension: 0.039" L x 0.022" W (1.00mm x 0.55mm); Supplier 1: DigiKey; Supplier Part Number 1: 490-16655-1-ND; Value: 600 Ohms @ 100MHz
IC8 = W25Q32JVSSIQ TR: IC FLASH 32M SPI 133MHZ 8SOIC; Manufacturer: Winbond Electronics; Memory Interface: SPI - Quad I/O; Memory Size: 32Mb (4M x 8); Memory Type: Non-Volatile; Voltage - Supply: 2.7V ~ 3.6V; Write Cycle Time - Word, Page: 3ms; Part Number: W25Q32JVSSIQ TR; Clock Frequency: 133MHz; ComponentLink1Description: Datasheet; ComponentLink1URL: http://www.winbond.com/resource-files/w25q32jv%20revg%2003272018%20plus.pdf; ComponentLink2Description: DigiKey Link; ComponentLink2URL: http://digikey.com/product-detail/en/winbond-electronics/W25Q32JVSSIQ-TR/W25Q32JVSSIQCT-ND/7393546; Device Package: 8-SOIC (0.209", 5.30mm Width); LastUpdated: 30/03/2020 15:35:36; Lifecycle Status: Active; Memory Format: FLASH; Minimum Order: 1; Mounting Type: Surface Mount; Operating Temperature: -40°C ~ 85°C (TA); Package / Case: 8-SOIC (0.209", 5.30mm Width); Packaging: TapeAndReel; PartId: 857; Part Status: Active; Price: 0.54; Series: SpiFlash®; Supplier 1: DigiKey; Supplier Part Number 1: W25Q32JVSSIQCT-ND; Supplier Device Package: 8-SOIC; Technology: FLASH - NOR
IC9 = EFM32TG11B520F128GM32-B: LOW PWR MCU CORTEX-M0+ QFN32 128; Manufacturer: Silicon Labs; Connectivity: CANbus, I²C, IrDA, LINbus, SmartCard, SPI, UART/USART; Core Processor: ARM® Cortex®-M0+; Core Size: 32-Bit; Data Converters: A/D 12bit SAR; D/A 12bit; Number of I/O: 22; Oscillator Type: Internal; Peripherals: Brown-out Detect/Reset, DMA, I²S, POR, PWM, WDT; Program Memory Size: 128KB (128K x 8); Program Memory Type: FLASH; RAM Size: 32K x 8; Speed: 48MHz; Voltage - Supply (Vcc/Vdd): 1.8V ~ 3.8V; Part Number: EFM32TG11B520F128GM32-B; ComponentLink1Description: Datasheet; ComponentLink1URL: https://www.silabs.com/documents/public/data-sheets/efm32tg11-datasheet.pdf; ComponentLink2Description: DigiKey Link; ComponentLink2URL: http://digikey.com/product-detail/en/silicon-labs/EFM32TG11B520F128GM32-B/336-5690-ND/9677682; Device Package: 32-WFQFN Exposed Pad; LastUpdated: 30/03/2020 15:34:59; Lifecycle Status: Active; Minimum Order: 1; Mounting Type: Surface Mount; Operating Temperature: -40°C ~ 85°C (TA); Package / Case: 32-WFQFN Exposed Pad; Packaging: Tray; PartId: 197; Part Status: Active; Price: 2.06; Series: Tiny Gecko 1; Supplier 1: DigiKey; Supplier Part Number 1: 336-5690-ND; Supplier Device Package: 32-QFN (5x5)
R22-R24 = ERJ-1GNF3301C: as R27 on sheet Accelerometer; Part Number: ERJ-1GNF3301C; Value: 3.3 kOhms; ComponentLink1Description: Datasheet; ComponentLink1URL: https://industrial.panasonic.com/cdbs/www-data/pdf/RDA0000/AOA0000C304.pdf; ComponentLink2Description: DigiKey Link; ComponentLink2URL: http://digikey.com/product-detail/en/panasonic-electronic-components/ERJ-1GNF3301C/P122937CT-ND/8342813; Composition: Thick Film; Device Package: 0201 (0603 Metric); Features: Automotive AEC-Q200; Height - Seated (Max): 0.010" (0.26mm); LastUpdated: 21/01/2020 00:04:10; Lifecycle Status: Active; Minimum Order: 1; Number of Terminations: 2; Operating Temperature: -55°C ~ 125°C; Package / Case: 0201 (0603 Metric); Packaging: TapeAndReel; PartId: 4142; Part Status: Active; Price: 0.01; Ratings: AEC-Q200; Resistance: 3.3 kOhms; Series: ERJ; Size / Dimension: 0.024" L x 0.012" W (0.60mm x 0.30mm); Supplier 1: DigiKey; Supplier Part Number 1: P122937CT-ND; Supplier Device Package: 0201; Tolerance: ±1%
S1 = KXT 311 LHS: SWITCH TACTILE SPST-NO 0.02A 15V; Manufacturer: C&K; Actuator Height off PCB, Vertical: 0.60mm; Actuator Orientation: Top Actuated; Actuator Type: Standard; Contact Rating @ Voltage: 0.02A @ 15VDC; Illumination: Non-Illuminated; Operating Force: 100gf; Outline: 3.00mm x 2.00mm; Switch Function: Off-Mom; Part Number: KXT 311 LHS; Circuit: SPST-NO; ComponentLink1Description: Datasheet; ComponentLink1URL: https://dznh3ojzb2azq.cloudfront.net/products/Tactile/KXT3/documents/datasheet.pdf; ComponentLink2Description: DigiKey Link; ComponentLink2URL: http://digikey.com/product-detail/en/c-k/KXT-311-LHS/CKN10777CT-ND/6599755; LastUpdated: 25/01/2020 19:35:40; Lifecycle Status: Active; Minimum Order: 1; Mounting Type: Surface Mount; Operating Temperature: -40°C ~ 85°C; Packaging: TapeAndReel; Part Status: Active; Price: 0.11; Series: KXT3; Supplier 1: DigiKey; Supplier Part Number 1: CKN10777CT-ND; Termination Style: SMD (SMT) Tab

## Nets that join several sheets
3V3: Power Regulation (A3.4 A3.6 C9.2 R6.2), CAN (C61.2 IC14.5), LTE Module (C53.2 IC10.19 R25.1), GPS (FB2.1 R26.1), Accelerometer (FB5.1 R27.2 R28.2 R29.2), Microcontroller (7 pins)
3V8: Power Regulation (5 pins), LTE Module (9 pins)
5V: Power Regulation (C13.2 IC2.3), CAN (C60.2 IC14.3)
8V: Power Regulation (9 pins), Battery (D6.2 IC4.2)
8VBATT: Battery (IC4.3 IC5.7), Battery Power (C28.2 IC7.6 R18.1)
8VIN: Power Input (A1.5 C4.2), Battery (6 pins)
GND: Power Regulation (20 pins), Power Input (20 pins), Battery (19 pins), CAN (6 pins), LTE Module (73 pins), GPS (8 pins), Accelerometer (7 pins), Battery Power (9 pins), Microcontroller (14 pins)
VBATT: Battery (7 pins), Battery Power (C24.2 C25.2 IC7.9 L2.1)
ACCEL_INT: Accelerometer (IC13.12), Microcontroller (IC9.3)
CAN_RX: CAN (IC14.4), Microcontroller (IC9.27 J4.4)
CAN_SILENT: CAN (IC14.8), Microcontroller (IC9.28 J4.2)
CAN_TX: CAN (IC14.1), Microcontroller (IC9.29 J4.6)
GPS_RST: GPS (A6.8), Microcontroller (IC9.8)
GPS_RX: GPS (FB4.2), Microcontroller (IC9.5)
GPS_TX: GPS (FB3.2), Microcontroller (IC9.26)
I2C_SCL: Battery (IC6.11), LTE Module (A4.27), GPS (A6.19), Accelerometer (IC13.1 R28.1), Microcontroller (IC9.2)
I2C_SDA: Battery (IC6.10), LTE Module (A4.26), GPS (A6.18), Accelerometer (IC13.4 R29.1), Microcontroller (IC9.1)
LTE_3V3_CTS: LTE Module (IC10.17), Microcontroller (IC9.16)
LTE_3V3_DCD: LTE Module (IC10.15), Microcontroller (IC9.25)
LTE_3V3_DSR: LTE Module (IC10.12), Microcontroller (IC9.15)
LTE_3V3_DTR: LTE Module (IC10.14), Microcontroller (IC9.24)
LTE_3V3_RI: LTE Module (IC10.13), Microcontroller (IC9.18)
LTE_3V3_RTS: LTE Module (IC10.16), Microcontroller (IC9.17)
LTE_3V3_RX: LTE Module (IC10.20), Microcontroller (IC9.31)
LTE_3V3_TX: LTE Module (IC10.18), Microcontroller (IC9.32)
LTE_RESET: LTE Module (A4.18), Microcontroller (IC9.13)